# EAGLE design ShifterBit (EAGLE 7.4.0)
CNAME: Board Layout; CREVISION: A; DESIGNER: Joël Gähwiler
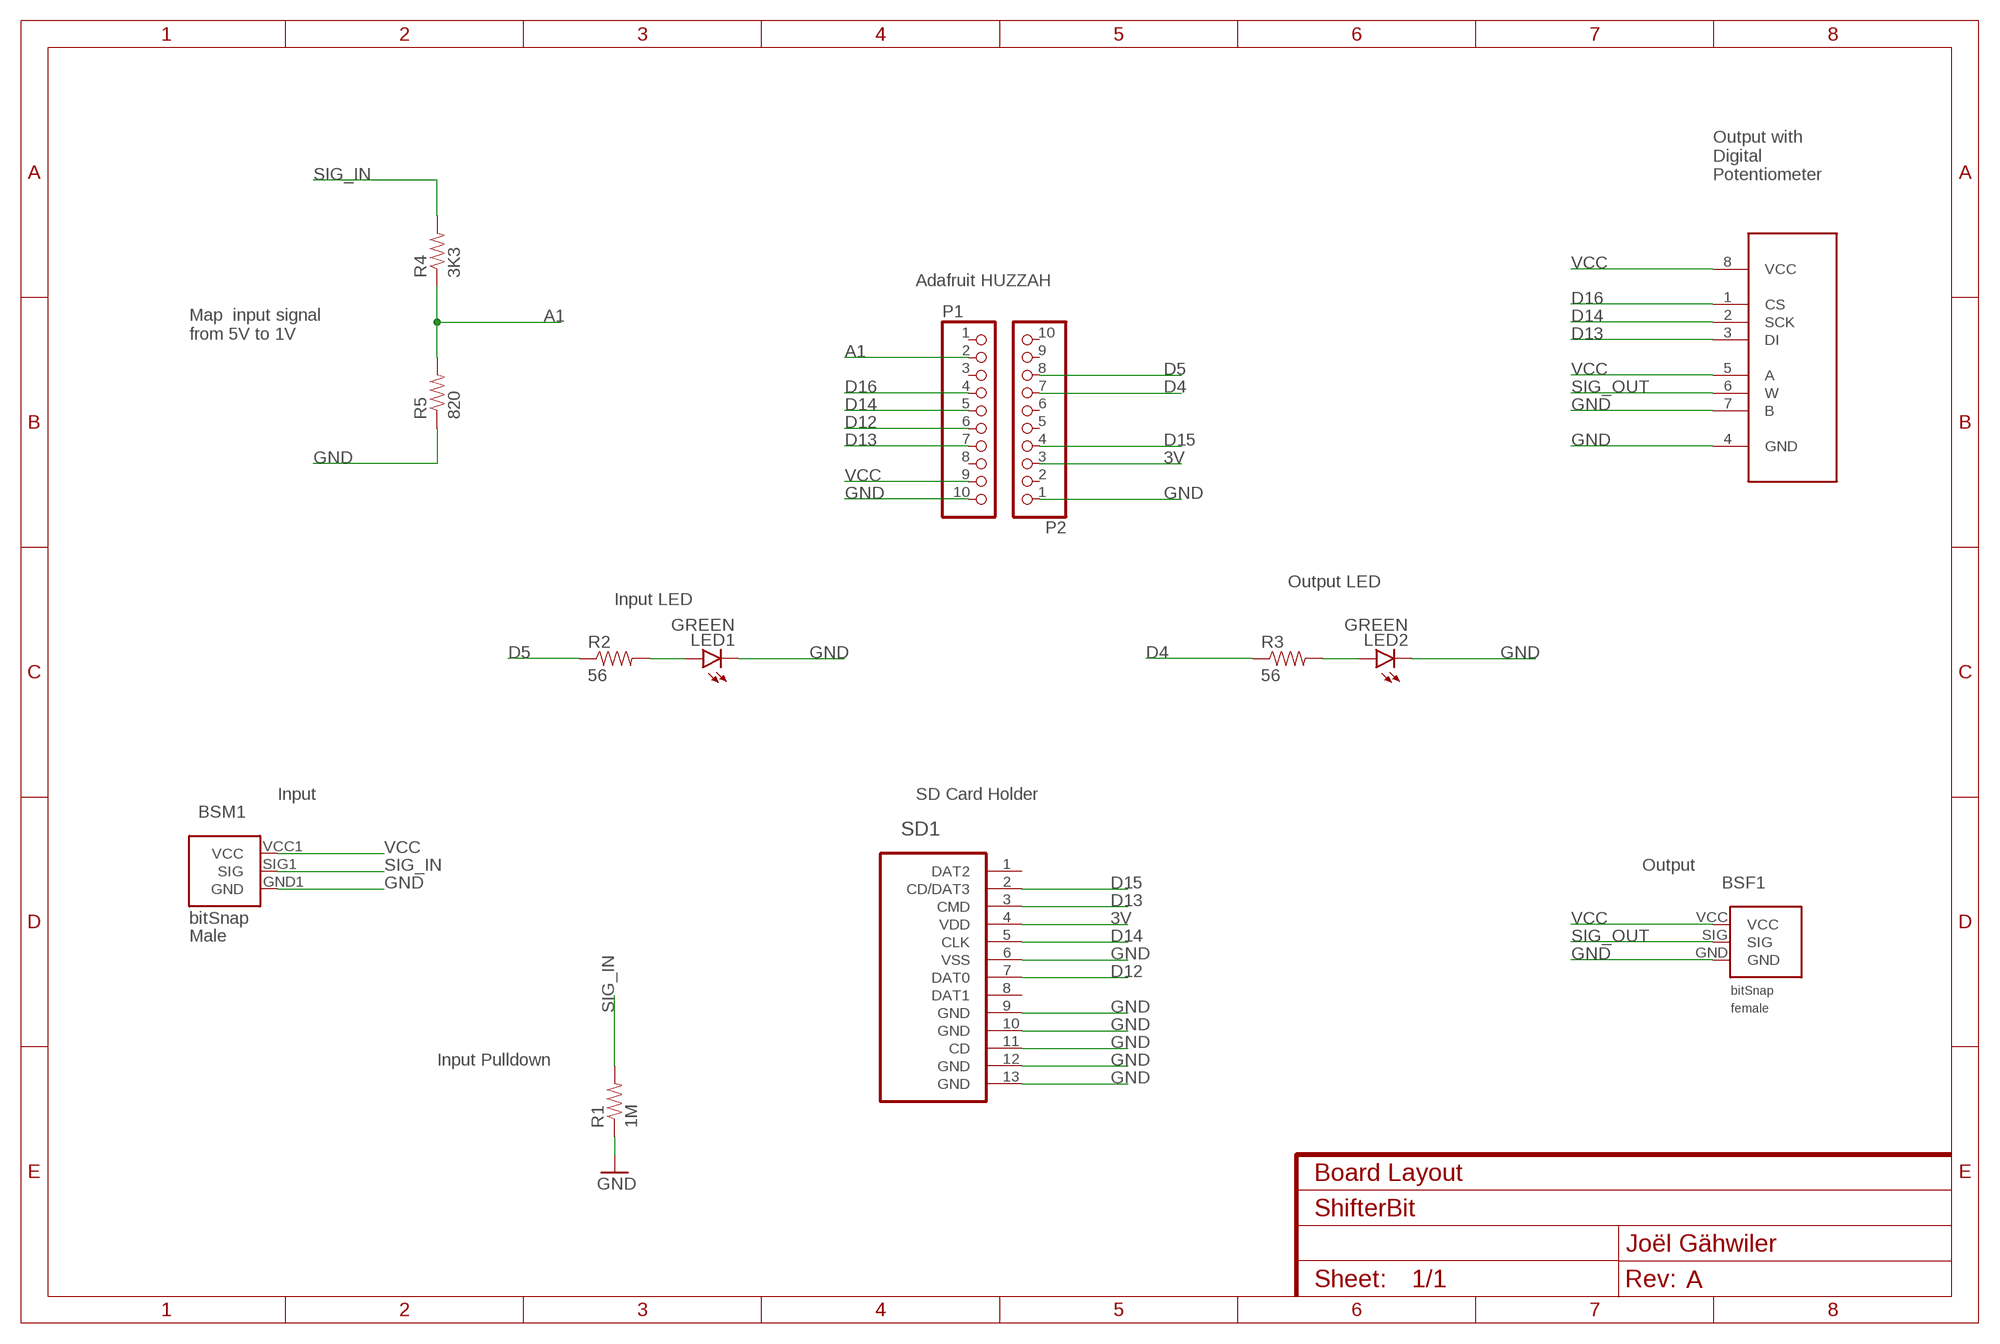
[diagram p0: schematic, sheet 1]

## Parts
BSF1  BITSNAP_V03_FEMALE  [BITSNAP_V03_FEMALE]
BSM1  BITSNAP_V03_MALE  [BITSNAP_V03_MALE]
DPOT1  MCP41XXX  [SO08]
LED1  GREEN  LED-GREENLARGE  [LED-1206]
LED2  GREEN  LED-GREENLARGE  [LED-1206]
P1  PINHD-1X10  [1X10-BIG]
P2  PINHD-1X10  [1X10-BIG]
R1  1M  RESISTOR1206  [RES-1206]
R2  56  RESISTOR1206  [1206]
R3  56  RESISTOR1206  [1206]
R4  3K3  RESISTOR1206  [1206]
R5  820  RESISTOR1206  [1206]
SD1  HIROSE_DM3CS-SF  [HIROSE_DM3CS-SF]

## Nets
3V: P2.3 SD1.4(VDD)
A1: P1.2 R4.1 R5.2
D4: P2.7 R3.1
D5: P2.8 R2.1
D12: P1.6 SD1.7(DAT0)
D13: DPOT1.3(DI) P1.7 SD1.3(CMD)
D14: DPOT1.2(SCK) P1.5 SD1.5(CLK)
D15: P2.4 SD1.2(CD/DAT3)
D16: DPOT1.1(CS) P1.4
GND: BSF1.GND BSM1.GND1(GND) DPOT1.4(GND) DPOT1.7(B) LED1.C LED2.C P1.10 P2.1 R1.1 R5.1 SD1.6(VSS) SD1.9(GND) SD1.10(GND) SD1.11(CD) SD1.12(GND) SD1.13(GND)
N$4: LED1.A R2.2
N$9: LED2.A R3.2
SIG_IN: BSM1.SIG1(SIG) R1.2 R4.2
SIG_OUT: BSF1.SIG DPOT1.6(W)
VCC: BSF1.VCC BSM1.VCC1(VCC) DPOT1.5(A) DPOT1.8(VCC) P1.9
Unconnected: P1.1 P1.3 P1.8 P2.2 P2.5 P2.6 P2.9 P2.10 SD1.1(DAT2) SD1.8(DAT1)

## Notes on the sheet
- Output with
  Digital
  Potentiometer
- Adafruit HUZZAH
- Map  input signal
  from 5V to 1V
- Output LED
- Input LED
- Input | SD Card Holder
- Output
- Input Pulldown

## Library data of the parts
BSF1 = bitSnap:BITSNAP_V03_FEMALE
BSM1 = bitSnap:BITSNAP_V03_MALE
DPOT1 = SparkFun-AnalogIC:MCP41XXX: SPI controlled single digital potentiometer by Microchip PID: COM-10613
LED1 LED2 = SparkFun-LED:LED-GREEN: Various green LEDs Green LEDs used in SFE Production 0603- DIO-00821 LARGE- DIO-00862 LILYPAD- DIO-09910; PROD_ID: DIO-00862
P1 P2 = adafruit:PINHD-1X10: Pin header 1x10 0.1" spacing With round pins
R1 = LITTLEBITS:RESISTOR
R2-R5 = SparkFun-Passives:RESISTOR: Resistor Basic schematic elements and footprints for 0603, 1206, and PTH resistors.
SD1 = HIROSE-DM3CS-SF:HIROSE_DM3CS-SF: DM3CS, Hinge, Push -Pull (no ejection mechanism), Top board mounting (Standard); MPN: DM3CS-SF; OC_FARNELL: 1764376; OC_NEWARK: 35R0581; PACKAGE: SMD - microSD; SUPPLIER: HIROSE

## Board
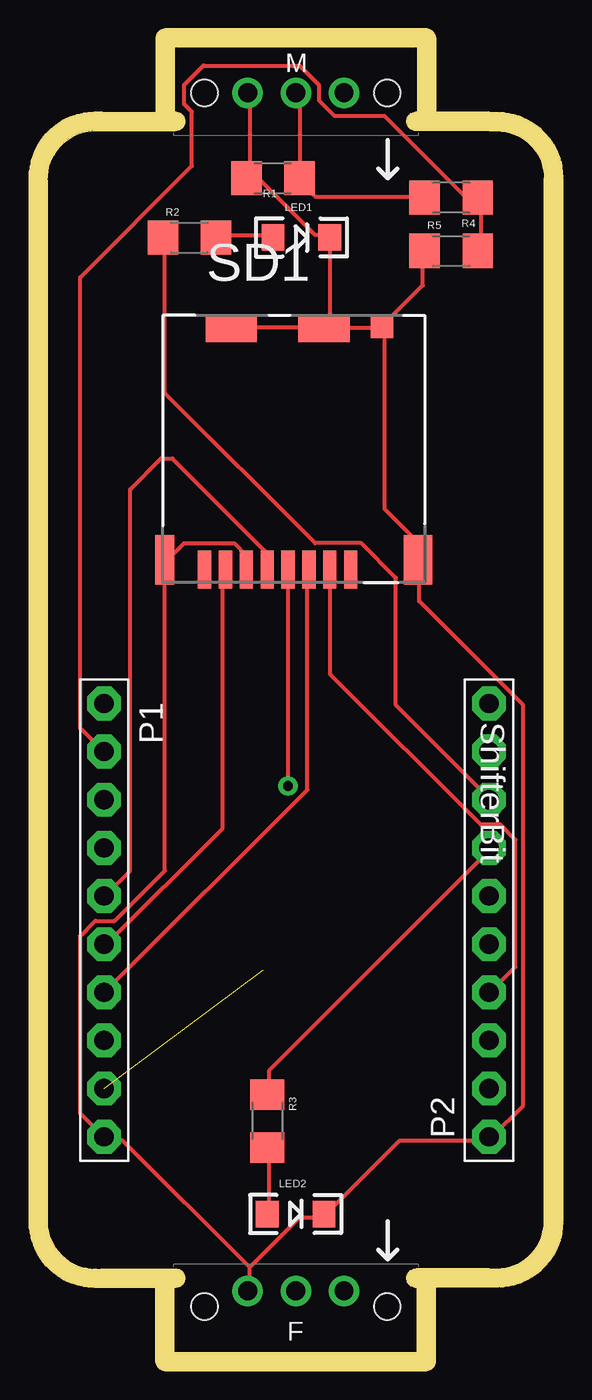
[diagram p1: board, top side]
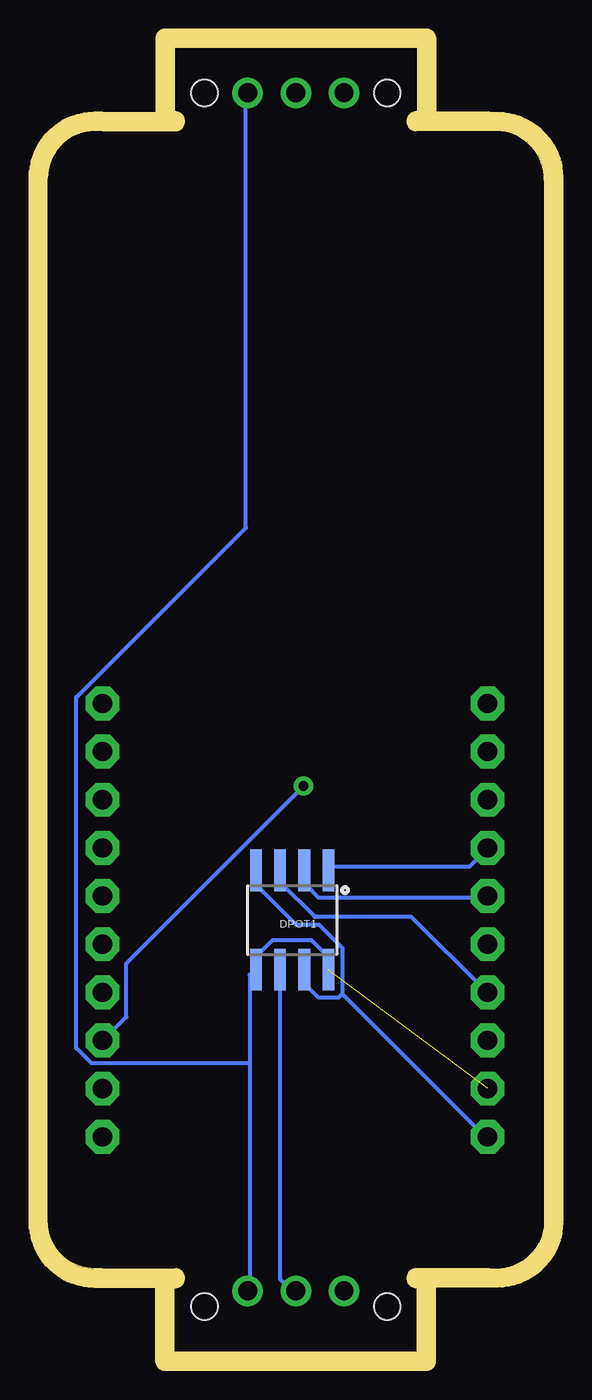
[diagram p2: board, bottom side, seen from below]

Size 26.2 x 68.83 mm. Coordinates in mm from the lower left corner, seen from the top.
Outline: 2.9,4.4 arc-90 0,6.6 0,61.82 arc-90 2.5,64.43 2.9,64.43
Outline: 23.3,64.43 23.7,64.43 arc-90 26.2,61.92 26.2,6.9 arc-90 23.7,4.4 23.3,4.4
Copper layers (1*16): Top 0.035mm / dielectric 1.5mm / Bottom 0.035mm
Design rules "SparkFun": minimum track width 8mil, minimum drill 20mil, track to track 8mil, track to pad 8mil, pad to pad 8mil, via to via 8mil, smd to smd 8mil, copper to edge 10mil, drill to drill 8mil, minimum pad ring 12mil, minimum via ring 10mil, stop-mask expansion 4mil, vias tented up to drill 25mil, thermal gap 10mil
Milling: 10 lines

### Footprints (pad centres in the part's own frame; a part is rotated, then mirrored left to right if it is on the bottom)
BITSNAP_V03_FEMALE = drill 1: GND 4.065,3.44; SIG 6.605,3.44; VCC 9.145,3.44 | hole 1.4: 1.785,2.61; 11.425,2.61
BITSNAP_V03_MALE = drill 1: GND1 9.145,2.61; SIG1 6.605,2.61; VCC1 4.065,2.61 | hole 1.4: 1.785,2.61; 11.425,2.61
SO08 = smd 0.61 x 2.21: 1 -1.905,-2.616; 2 -0.635,-2.616; 3 0.635,-2.616; 4 1.905,-2.616; 5 1.905,2.616; 6 0.635,2.616; 7 -0.635,2.616; 8 -1.905,2.616
LED-1206 = smd 1.2 x 1.4: A -1.5,0; C 1.5,0
1X10-BIG = drill 1.016 pad 1.778 octagon: 1 -11.43,0; 2 -8.89,0; 3 -6.35,0; 4 -3.81,0; 5 -1.27,0; 6 1.27,0; 7 3.81,0; 8 6.35,0; 9 8.89,0; 10 11.43,0
RES-1206 = smd 1.6 x 1.8: 1 -1.4,0; 2 1.4,0
1206 = smd 1.6 x 1.8: 1 -1.4,0; 2 1.4,0
HIROSE_DM3CS-SF = smd 0.7 x 2: 1 0,0; 2 -1.1,0; 3 -2.2,0; 4 -3.3,0; 5 -4.4,0; 6 -5.5,0; 7 -6.6,0; 8 -7.7,0 | smd 1.5 x 2.6: 9 3.55,0.5 | smd 1.2 x 1.2: 10 1.65,12.8 | smd 2.7 x 1.4: 11 -1.4,12.7; 12 -6.3,12.7 | smd 1 x 2.6: 13 -9.8,0.5

### Placement (x,y rotation side)
BSF1  6.5,-0.21 0 top
BSM1  19.71,69.04 180 top
DPOT1  13.29,22.79 180 bottom
LED1  13.39,58.79 0 top
LED2  13.09,7.29 0 top
P1  2.99,22.79 270 top
P2  23.29,22.79 90 top
R1  11.89,61.92 0 top
R2  7.49,58.79 0 top
R3  11.59,12.19 270 top
R4  21.29,60.89 180 top
R5  21.29,58.09 0 top
SD1  15.99,41.29 0 top

### Tracks (layer width: path | path; a pad name or v marks a point on that pad's centre or on a via)
3V  (via drill 0.51)
  Top 0.203: v12.69,29.86 12.69,41.24 SD1.4
  Bottom 0.203: v12.69,29.86 22.04,20.52 22.04,17.67 23.26,16.45 P2.3
A1
  Top 0.203: R5.2 22.85,58.11 22.85,60.75 R4.1 22.65,60.95 22.04,60.95 17.77,65.22 15.13,65.22 14.32,66.03 14.32,66.85 13.3,67.86 8.22,67.86 7.21,66.85 7.21,65.83 7.61,65.42 7.61,62.58 1.72,56.69 1.72,32.91 2.94,31.69 P1.2
D4
  Top 0.203: R3.1 11.68,13.61 11.68,14.83 23.26,26.41 P2.7
D5
  Top 0.203: R2.1 6.19,58.72 6.19,50.59 14.11,42.66 16.55,42.66 18.38,40.84 18.38,34.13 23.26,29.25 P2.8
D12
  Top 0.203: SD1.7 9.24,41.24 9.24,27.63 3.14,21.53 P1.6
D13
  Top 0.203: SD1.3 13.71,41.24 13.71,29.66 3.14,19.09 P1.7
  Bottom 0.203: DPOT1.3 13.91,25.39 13.91,24.78 12.08,22.95 7,22.95 3.14,19.09 P1.7
D14
  Top 0.203: SD1.5 11.47,41.45 11.47,42.26 6.6,47.14 5.99,47.14 4.36,45.51 4.36,25.39 3.14,24.17 P1.5
  Bottom 0.203: DPOT1.2 12.49,25.39 12.49,24.58 11.88,23.97 3.14,23.97 P1.5
D15
  Top 0.203: SD1.2 14.93,41.24 14.93,35.76 22.85,27.83 23.87,27.83 24.68,27.02 24.68,20.31 23.46,19.09 P2.4
D16
  Bottom 0.203: DPOT1.1 11.27,25.6 3.95,25.6 3.14,26.41 P1.4
GND
  Top 0.203: BSM1.GND1 10.66,66.24 10.66,61.97 R1.1 10.66,61.77 11.27,61.77 14.11,58.92 14.72,58.92 LED1.C 14.93,58.72 14.93,54.04 | 14.93,54.04 14.72,54.04 SD1.11 | 14.93,54.04 17.57,54.04 SD1.10 | 14.93,54.04 SD1.11 | R5.1 19.8,57.91 19.8,56.28 17.77,54.25 SD1.10 | SD1.10 17.77,54.04 17.77,44.49 19.4,42.87 19.4,41.85 SD1.9 19.6,41.65 19.6,39.62 25.09,34.13 25.09,13 23.46,11.37 P2.1 23.26,11.17 18.58,11.17 14.72,7.31 LED2.C 14.52,7.11 13.3,7.11 10.66,4.46 | SD1.12 9.85,54.04 14.52,54.04 SD1.11 | SD1.6 10.46,41.45 10.46,42.06 9.85,42.66 7.21,42.66 6.39,41.85 SD1.13 6.19,41.65 6.19,25.39 3.55,22.75 2.53,22.75 1.72,21.94 1.72,12.59 2.94,11.37 P1.10 3.14,11.17 3.95,11.17 10.66,4.46 | 10.66,4.46 10.66,3.24 BSF1.GND
  Bottom 0.203: 10.66,18.89 10.86,18.69 11.88,18.69 12.49,19.3 12.49,20.11 DPOT1.7 | 10.66,18.89 10.66,21.33 11.88,22.55 13.1,22.55 15.13,24.58 15.13,25.39 DPOT1.4 | 10.66,18.89 3.14,11.37 P1.10
N$4
  Top 0.203: LED1.A 11.88,58.92 9.03,58.92 R2.2
N$9
  Top 0.203: LED2.A 11.68,7.31 11.68,10.76 R3.2
SIG_IN
  Top 0.203: BSM1.SIG1 13.3,66.24 13.3,61.97 R1.2 13.3,61.77 14.11,60.95 19.8,60.95 R4.2
SIG_OUT
  Bottom 0.203: DPOT1.6 13.91,20.11 13.91,3.85 13.3,3.24 BSF1.SIG
VCC  (1 unrouted)
  Bottom 0.203: DPOT1.8 11.47,20.31 11.47,20.92 12.29,21.74 14.32,21.74 15.13,20.92 15.13,20.31 DPOT1.5 15.33,20.11 15.54,19.91 15.54,15.23 | 15.54,15.23 15.54,3.24 BSF1.VCC | 15.54,15.23 23.87,15.23 24.68,16.05 24.68,34.54 15.74,43.48 15.74,66.24 BSM1.VCC1

### Text on the board
tPlace: ShifterBit